# EAGLE schematic weapon_alfa (EAGLE 5.07)
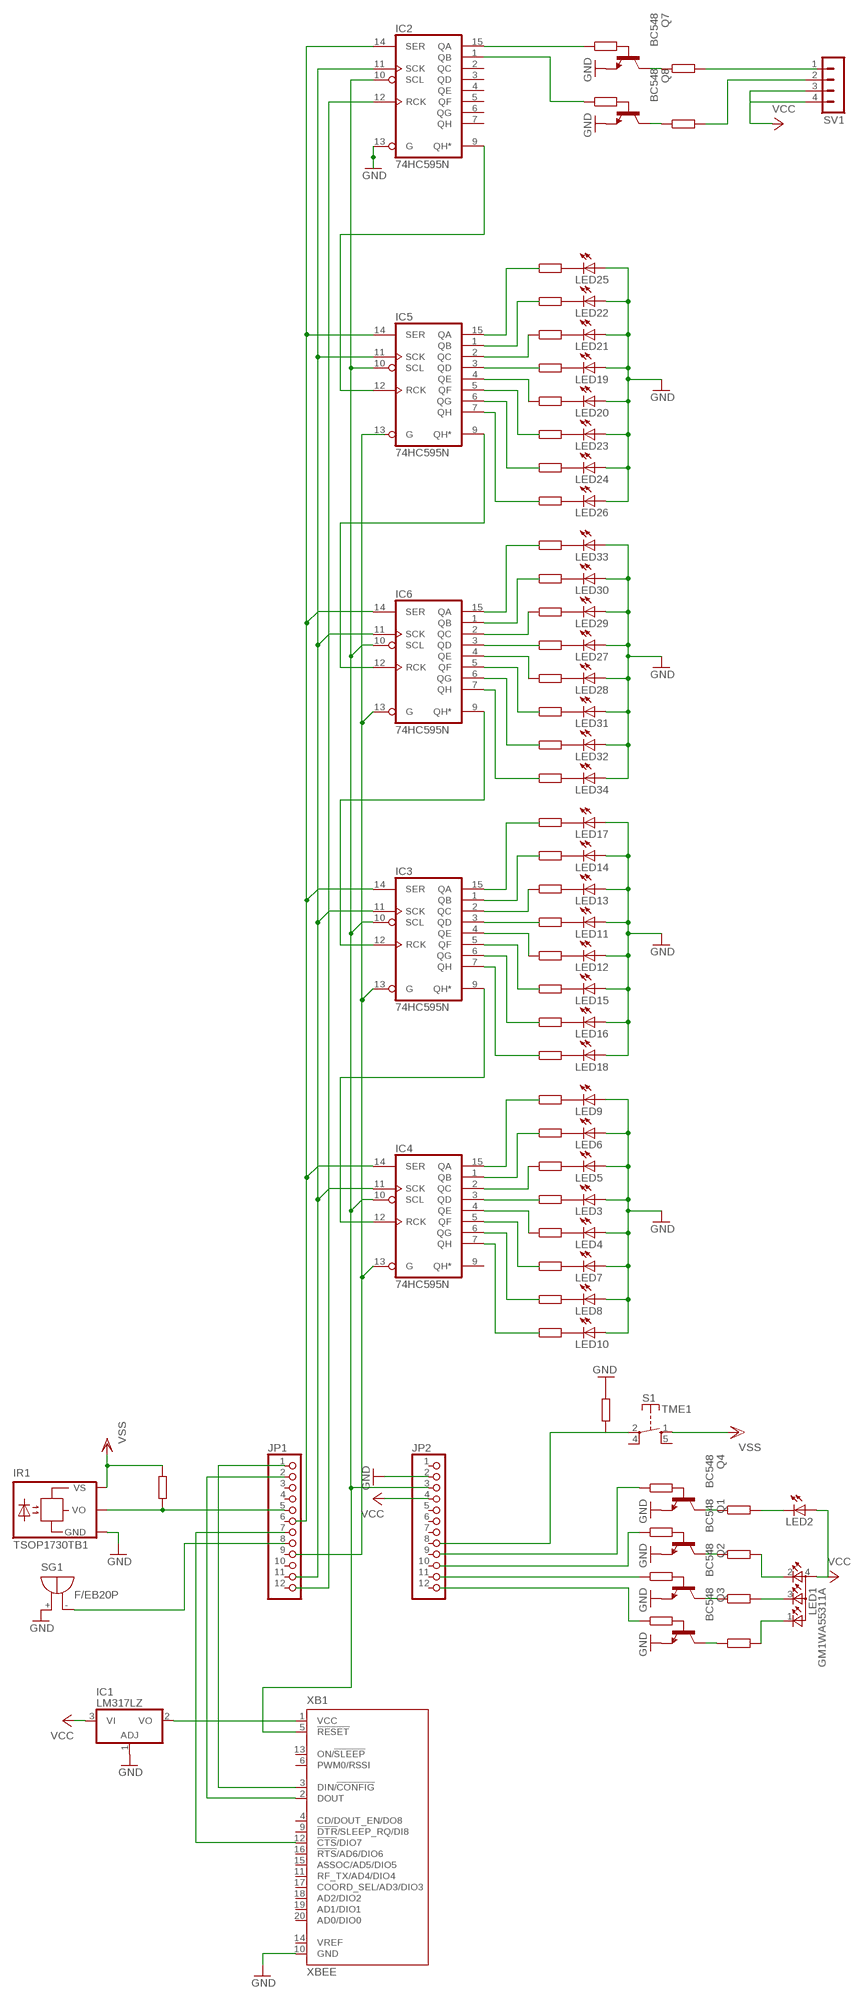
[diagram p0: schematic, sheet 1]

## Parts
IC1  LM317LZ  [TO92]
IC2  74HC595N  [DIL16]
IC3  74HC595N  [DIL16]
IC4  74HC595N  [DIL16]
IC5  74HC595N  [DIL16]
IC6  74HC595N  [DIL16]
IR1  TSOP1730TB1  [TSOP17_TB1]
JP1  PINHD-1X12  [1X12]
JP2  PINHD-1X12  [1X12]
LED1  GM1WA55311A  [GM1WA55311A]
LED2  LED5MM  [LED5MM]
LED3  LED5MM  [LED5MM]
LED4  LED5MM  [LED5MM]
LED5  LED5MM  [LED5MM]
LED6  LED5MM  [LED5MM]
LED7  LED5MM  [LED5MM]
LED8  LED5MM  [LED5MM]
LED9  LED5MM  [LED5MM]
LED10  LED5MM  [LED5MM]
LED11  LED5MM  [LED5MM]
LED12  LED5MM  [LED5MM]
LED13  LED5MM  [LED5MM]
LED14  LED5MM  [LED5MM]
LED15  LED5MM  [LED5MM]
LED16  LED5MM  [LED5MM]
LED17  LED5MM  [LED5MM]
LED18  LED5MM  [LED5MM]
LED19  LED5MM  [LED5MM]
LED20  LED5MM  [LED5MM]
LED21  LED5MM  [LED5MM]
LED22  LED5MM  [LED5MM]
LED23  LED5MM  [LED5MM]
LED24  LED5MM  [LED5MM]
LED25  LED5MM  [LED5MM]
LED26  LED5MM  [LED5MM]
LED27  LED5MM  [LED5MM]
LED28  LED5MM  [LED5MM]
LED29  LED5MM  [LED5MM]
LED30  LED5MM  [LED5MM]
LED31  LED5MM  [LED5MM]
LED32  LED5MM  [LED5MM]
LED33  LED5MM  [LED5MM]
LED34  LED5MM  [LED5MM]
Q1  BC548  [TO92-EBC]
Q2  BC548  [TO92-EBC]
Q3  BC548  [TO92-EBC]
Q4  BC548  [TO92-EBC]
Q7  BC548  [TO92-EBC]
Q8  BC548  [TO92-EBC]
S1  TME1  [TME1]
SG1  F/EB20P  [F/EB20P]
SV1  MA04-1  [MA04-1]
XB1  XBEE  [XBEE]

## Nets
GND: IC1.1(ADJ) IC2.13(G) IR1.GND JP2.2 Q1.E Q2.E Q3.E Q4.E Q7.E Q8.E SG1.+ XB1.10(GND)
LASER: IC2.1(QB)
N$1: LED1.2(CRED)
N$2: LED1.3(CBLUE)
N$3: LED1.1(CGREEN)
N$4: Q3.C
N$5: Q2.C
N$6: Q1.C
N$7: JP1.1 XB1.3(DIN/!CONFIG)
N$8: JP1.2 XB1.2(DOUT)
N$9: IC1.2(VO) XB1.1(VCC)
N$13: IR1.VO JP1.5
N$14: SG1.-
N$15: S1.2(P)
N$16: JP1.7 XB1.12(!CTS!/DIO7)
N$17: Q4.C
N$19: LED2.K(C)
N$20: IC4.15(QA)
N$21: IC3.13(G) IC4.13(G) IC6.13(G)
N$22: LED3.A LED4.A LED5.A LED6.A LED7.A LED8.A LED9.A LED10.A LED11.A LED12.A LED13.A LED14.A LED15.A LED16.A LED17.A LED18.A LED19.A LED20.A LED21.A LED22.A LED23.A LED24.A LED25.A LED26.A LED27.A LED28.A LED29.A LED30.A LED31.A LED32.A LED33.A LED34.A ; supply symbol labelled GND
N$25: IC5.9(QH*) IC6.12(RCK)
N$27: IC3.15(QA)
N$28: IC4.1(QB)
N$29: IC3.1(QB)
N$30: IC4.2(QC)
N$31: IC3.2(QC)
N$32: IC4.3(QD)
N$33: IC3.3(QD)
N$34: IC4.4(QE)
N$35: IC3.4(QE)
N$36: IC4.5(QF)
N$37: IC3.5(QF)
N$38: IC4.6(QG)
N$39: IC3.6(QG)
N$40: IC3.7(QH)
N$41: IC3.12(RCK) IC6.9(QH*)
N$42: IC3.9(QH*) IC4.12(RCK)
N$46: IC5.15(QA)
N$47: IC5.1(QB)
N$48: IC4.7(QH)
N$50: Q7.C
N$51: IC5.2(QC)
N$52: IC5.3(QD)
N$53: IC5.4(QE)
N$54: IC5.5(QF)
N$55: IC5.6(QG)
N$56: IC5.7(QH)
N$58: IC6.15(QA)
N$59: IC6.1(QB)
N$60: IC6.2(QC)
N$61: IC6.3(QD)
N$62: IC6.4(QE)
N$63: IC6.5(QF)
N$64: IC6.6(QG)
N$65: IC6.7(QH)
N$66: Q8.C
N$67: SV1.2
N$72: IC2.9(QH*) IC5.12(RCK)
N$73: IC2.14(SER) IC3.14(SER) IC4.14(SER) IC5.14(SER) IC6.14(SER)
N$74: IC2.11(SCK) IC3.11(SCK) IC4.11(SCK) IC5.11(SCK) IC6.11(SCK)
N$75: IC2.12(RCK)
N$76: IC2.10(SCL) IC3.10(SCL) IC4.10(SCL) IC5.10(SCL) IC6.10(SCL) JP2.3 XB1.5(!RESET)
VCC: IC1.3(VI) JP2.4 LED1.4(A) LED2.A SV1.3 SV1.4
VIBRATOR: IC2.15(QA)
VSS: IR1.VS S1.1(S)
Unconnected: IC2.2(QC) IC2.3(QD) IC2.4(QE) IC2.5(QF) IC2.6(QG) IC2.7(QH) IC4.9(QH*) IC5.13(G) JP1.3 JP1.4 JP1.6 JP1.8 JP1.9 JP1.10 JP1.11 JP1.12 JP2.1 JP2.5 JP2.6 JP2.7 JP2.8 JP2.9 JP2.10 JP2.11 JP2.12 LED3.K(C) LED4.K(C) LED5.K(C) LED6.K(C) LED7.K(C) LED8.K(C) LED9.K(C) LED10.K(C) LED11.K(C) LED12.K(C) LED13.K(C) LED14.K(C) LED15.K(C) LED16.K(C) LED17.K(C) LED18.K(C) LED19.K(C) LED20.K(C) LED21.K(C) LED22.K(C) LED23.K(C) LED24.K(C) LED25.K(C) LED26.K(C) LED27.K(C) LED28.K(C) LED29.K(C) LED30.K(C) LED31.K(C) LED32.K(C) LED33.K(C) LED34.K(C) Q1.B Q2.B Q3.B Q4.B Q7.B Q8.B S1.4(P) S1.5(S) SV1.1 XB1.4(CD/DOUT_EN/DO8) XB1.6(PWM0/RSSI) XB1.9(!DTR!/SLEEP_RQ/DI8) XB1.11(RF_TX/AD4/DIO4) XB1.13(ON/!SLEEP) XB1.14(VREF) XB1.15(ASSOC/AD5/DIO5) XB1.16(!RTS!/AD6/DIO6) XB1.17(COORD_SEL/AD3/DIO3) XB1.18(AD2/DIO2) XB1.19(AD1/DIO1) XB1.20(AD0/DIO0)

## Power pins joined to a net without a drawn wire
GND: IC2.8(GND) IC3.8(GND) IC4.8(GND) IC5.8(GND) IC6.8(GND)
VCC: IC2.16(VCC) IC3.16(VCC) IC4.16(VCC) IC5.16(VCC) IC6.16(VCC)

## Library data of the parts
IC1 = linear:*317: Positive VOLTAGE REGULATOR
IC2-IC6 = 74xx-eu:74*595: 8-bit SHIFT REGISTER, output latch
IR1 = telefunken:TSOP17*TB1: TSOP17..TB1 IR Receiver Modules for Remote Control Systems Source: http://www.vishay.com/docs/82042/82042.pdf
JP1 JP2 = pinhead:PINHD-1X12: PIN HEADER
LED1 = led:GM1WA55311A: Chip LED RGB Source: http://document.sharpsma.com/files/GM1WA55311A_SS.pdf
LED2-LED34 = led:LED: LED OSRAM: - CHIPLED LG R971, LG N971, LY N971, LG Q971, LY Q971, LO R971, LY R971 LH N974, LH R974 LS Q976, LO Q976, LY Q976 LO Q996 - Hyper CHIPLED LW Q18S LB Q993, LB Q99A, LB R99A - SideLED LS A670, LO A670, LY A670, LG A670, LP A670 LB A673, LV A673, LT A673, LW A673 LH A674 LY A675 LS A676, LA A676, LO A676, LY A676, LW A676 LS A679, LY A679, LG A679 - Hyper Micro SIDELED® LS Y876, LA Y876, LO Y876, LY Y876 LT Y87S - SmartLED LW L88C, LW L88S LB L89C, LB L89S, LG L890 LS L89K, LO L89K, LY L89K LS L896, LA L896, LO L896, LY L896 - TOPLED LS T670, LO T670, LY T670, LG T670, LP T670 LSG T670, LSP T670, LSY T670, LOP T670, LYG T670 LG T671, LOG T671, LSG T671 LB T673, LV T673, LT T673, LW T673 LH T674 LS T676, LA T676, LO T676, LY T676, LB T676, LH T676, LSB T676, LW T676 LB T67C, LV T67C, LT T67C, LS T67K, LO T67K, LY T67K, LW E67C LS E67B, LA E67B, LO E67B, LY E67B, LB E67C, LV E67C, LT E67C LW T67C LS T679, LY T679, LG T679 LS T770, LO T770, LY T770, LG T770, LP T770 LB T773, LV T773, LT T773, LW T773 LH T774 LS E675, LA E675, LY E675, LS T675 LS T776, LA T776, LO T776, LY T776, LB T776 LHGB T686 LT T68C, LB T68C - Hyper Mini TOPLED® LB M676 - Mini TOPLED Santana® LG M470 LS M47K, LO M47K, LY M47K Source: http://www.osram.convergy.de LUXEON: - LUMILED® LXK2-PW12-R00, LXK2-PW12-S00, LXK2-PW14-U00, LXK2-PW14-V00 LXK2-PM12-R00, LXK2-PM12-S00, LXK2-PM14-U00 LXK2-PE12-Q00, LXK2-PE12-R00, LXK2-PE12-S00, LXK2-PE14-T00, LXK2-PE14-U00 LXK2-PB12-K00, LXK2-PB12-L00, LXK2-PB12-M00, LXK2-PB14-N00, LXK2-PB14-P00, LXK2-PB14-Q00 LXK2-PR12-L00, LXK2-PR12-M00, LXK2-PR14-Q00, LXK2-PR14-R00 LXK2-PD12-Q00, LXK2-PD12-R00, LXK2-PD12-S00 LXK2-PH12-R00, LXK2-PH12-S00 LXK2-PL12-P00, LXK2-PL12-Q00, LXK2-PL12-R00 Source: www.luxeon.com KINGBRIGHT: KA-3528ASYC Source: www.kingbright.com
Q1-Q4 Q7 Q8 = transistor-npn:BC548*: NPN Transistor
S1 = switch-misc:TME1: SWITCH
SG1 = buzzer:F/EB20P: BUZZER Source: Buerklin
SV1 = con-lstb:MA04-1: PIN HEADER
XB1 = maxstream:XBEE: XBee (TM) /XBee-PRO(TM) OEM RF Modules Source: MaxStream, Inc. xbee_productmanual.pdf